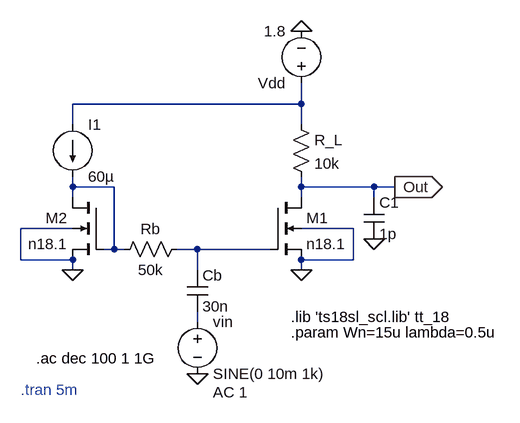
[diagram p0: schematic q4_1.asc]
q4_1.asc, the LTspice schematic file:
Version 4.1
SHEET 1 880 680
WIRE 128 -128 128 -160
WIRE 128 -128 -224 -128
WIRE -224 -96 -224 -128
WIRE 128 -96 128 -128
WIRE -224 0 -224 -16
WIRE -160 0 -224 0
WIRE 128 0 128 -16
WIRE 240 0 128 0
WIRE 272 0 240 0
WIRE -224 16 -224 0
WIRE 128 16 128 0
WIRE 240 16 240 0
WIRE -224 64 -304 64
WIRE 208 64 128 64
WIRE -160 96 -160 0
WIRE -160 96 -176 96
WIRE -144 96 -160 96
WIRE -32 96 -64 96
WIRE 80 96 -32 96
WIRE -304 112 -304 64
WIRE -224 112 -304 112
WIRE 208 112 208 64
WIRE 208 112 128 112
WIRE -224 128 -224 112
WIRE -32 128 -32 96
WIRE 128 128 128 112
WIRE -32 208 -32 192
FLAG 128 -240 0
FLAG 128 128 0
FLAG -32 288 0
FLAG -224 128 0
FLAG 272 0 Out
IOPIN 272 0 Out
FLAG 240 80 0
SYMBOL voltage 128 -144 R180
WINDOW 123 0 0 Left 0
WINDOW 39 0 0 Left 0
SYMATTR InstName Vdd
SYMATTR Value 1.8
SYMBOL nmos4 80 16 R0
SYMATTR InstName M1
SYMATTR Value n18.1
SYMATTR Value2 l={2*lambda} w={Wn} ad={5*lambda*Wn} as={5*lambda*Wn} pd={2*Wn + 10*lambda} ps={2*Wn + 10*lambda}
SYMBOL res 112 -112 R0
SYMATTR InstName R_L
SYMATTR Value 10k
SYMBOL cap -48 128 R0
SYMATTR InstName Cb
SYMATTR Value 30n
SYMBOL voltage -32 192 R0
WINDOW 123 24 124 Left 2
WINDOW 39 0 0 Left 0
SYMATTR Value2 AC 1
SYMATTR InstName vin
SYMATTR Value SINE(0 10m 1k)
SYMBOL res -48 80 R90
WINDOW 0 0 56 VBottom 2
WINDOW 3 32 56 VTop 2
SYMATTR InstName Rb
SYMATTR Value 50k
SYMBOL nmos4 -176 16 M0
SYMATTR InstName M2
SYMATTR Value n18.1
SYMATTR Value2 l={2*lambda} w={Wn} ad={5*lambda*Wn} as={5*lambda*Wn} pd={2*Wn + 10*lambda} ps={2*Wn + 10*lambda}
SYMBOL current -224 -96 R0
WINDOW 123 0 0 Left 0
WINDOW 39 0 0 Left 0
SYMATTR InstName I1
SYMATTR Value 60µ
SYMBOL cap 224 16 R0
SYMATTR InstName C1
SYMATTR Value 1p
TEXT 112 224 Left 2 !.param Wn=15u lambda=0.5u
TEXT 112 200 Left 2 !.lib 'ts18sl_scl.lib' tt_18
TEXT -304 312 Left 2 ;.tran 5m
TEXT -280 264 Left 2 !.ac dec 100 1 1G

The netlist it stands for:
* q4_1.asc
Vdd N001 0 1.8
M1 Out N003 0 0 n18.1 l={2*lambda} w={Wn} ad={5*lambda*Wn} as={5*lambda*Wn} pd={2*Wn + 10*lambda} ps={2*Wn + 10*lambda}
R_L N001 Out 10k
Cb N003 N004 30n
vin N004 0 SINE(0 10m 1k) AC 1
Rb N003 N002 50k
M2 N002 N002 0 0 n18.1 l={2*lambda} w={Wn} ad={5*lambda*Wn} as={5*lambda*Wn} pd={2*Wn + 10*lambda} ps={2*Wn + 10*lambda}
I1 N001 N002 60µ
C1 Out 0 1p
.model NMOS NMOS
.model PMOS PMOS
.lib standard.mos
.param Wn=15u lambda=0.5u
.lib 'ts18sl_scl.lib' tt_18
* .tran 5m
.ac dec 100 1 1G
.backanno
.end